# EAGLE design cable (EAGLE 7.7.0)
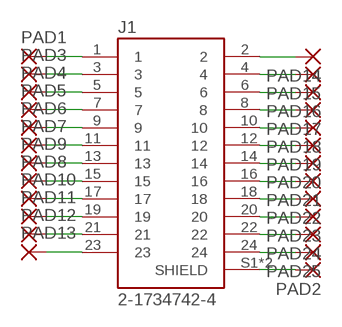
[diagram p0: schematic, sheet 1]

## Parts
J1  2-1734742-4  [TE_2-1734742-4]
PAD1  SMD2  [SMD1,27-2,54]
PAD2  SMD2  [SMD1,27-2,54]
PAD3  SMD2  [SMD1,27-2,54]
PAD4  SMD2  [SMD1,27-2,54]
PAD5  SMD2  [SMD1,27-2,54]
PAD6  SMD2  [SMD1,27-2,54]
PAD7  SMD2  [SMD1,27-2,54]
PAD8  SMD2  [SMD1,27-2,54]
PAD9  SMD2  [SMD1,27-2,54]
PAD10  SMD2  [SMD1,27-2,54]
PAD11  SMD2  [SMD1,27-2,54]
PAD12  SMD2  [SMD1,27-2,54]
PAD13  SMD2  [SMD1,27-2,54]
PAD14  SMD2  [SMD1,27-2,54]
PAD15  SMD2  [SMD1,27-2,54]
PAD16  SMD2  [SMD1,27-2,54]
PAD17  SMD2  [SMD1,27-2,54]
PAD18  SMD2  [SMD1,27-2,54]
PAD19  SMD2  [SMD1,27-2,54]
PAD20  SMD2  [SMD1,27-2,54]
PAD21  SMD2  [SMD1,27-2,54]
PAD22  SMD2  [SMD1,27-2,54]
PAD23  SMD2  [SMD1,27-2,54]
PAD24  SMD2  [SMD1,27-2,54]
PAD25  SMD2  [SMD1,27-2,54]

## Nets
N$1: J1.2 PAD14.1(P)
N$2: J1.4 PAD15.1(P)
N$3: J1.6 PAD16.1(P)
N$4: J1.8 PAD17.1(P)
N$5: J1.10 PAD18.1(P)
N$6: J1.12 PAD19.1(P)
N$7: J1.14 PAD20.1(P)
N$8: J1.16 PAD21.1(P)
N$9: J1.18 PAD22.1(P)
N$10: J1.20 PAD23.1(P)
N$11: J1.22 PAD24.1(P)
N$12: J1.24 PAD25.1(P)
N$13: J1.1 PAD1.1(P)
N$14: J1.3 PAD3.1(P)
N$15: J1.5 PAD4.1(P)
N$16: J1.7 PAD5.1(P)
N$17: J1.9 PAD6.1(P)
N$18: J1.11 PAD7.1(P)
N$19: J1.13 PAD9.1(P)
N$20: J1.15 PAD8.1(P)
N$21: J1.17 PAD10.1(P)
N$22: J1.19 PAD11.1(P)
N$23: J1.21 PAD12.1(P)
N$24: J1.23 PAD13.1(P)
N$25: J1.S1(SHIELD) J1.S2(SHIELD) PAD2.1(P)

## Library data of the parts
J1 = 2-1734742-4:2-1734742-4: Conn FPC Connector SKT 24 POS 0.5mm Solder ST SMD T/R; AVAILABILITY: Unavailable; COMMENT: 2-1734742-4; DESCRIPTION: Conn FPC Connector SKT 24 POS 0.5mm Solder ST SMD T/R; EU_ROHS_COMPLIANCE: Compliant; MF: TE Connectivity; MP: 2-1734742-4; PACKAGE: None; PRICE: None; TE_PURCHASE_URL: https://www.te.com/usa-en/product-2-1734742-4.html?te_bu=Cor&te_type=disp&te_campaign=seda_glo_cor-seda-global-disp-prtnr-fy19-seda-model-bom-cta_sma-317_1&elqCampaignId=32493
PAD1-PAD25 = wirepad:SMD2: SMD PAD

## Board
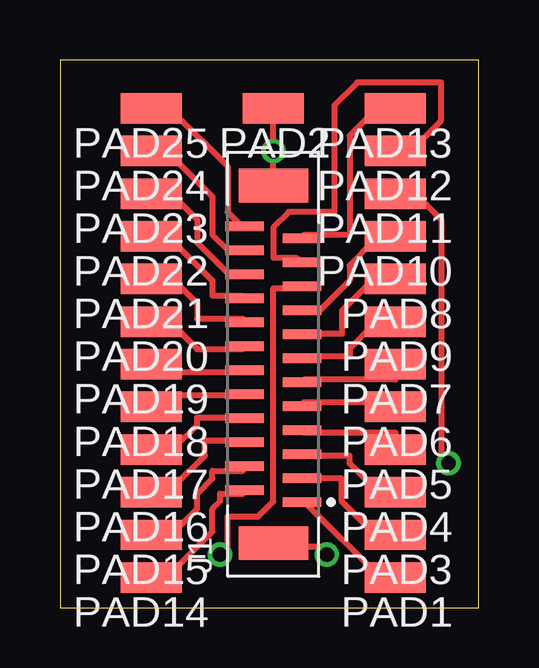
[diagram p1: board, top side]
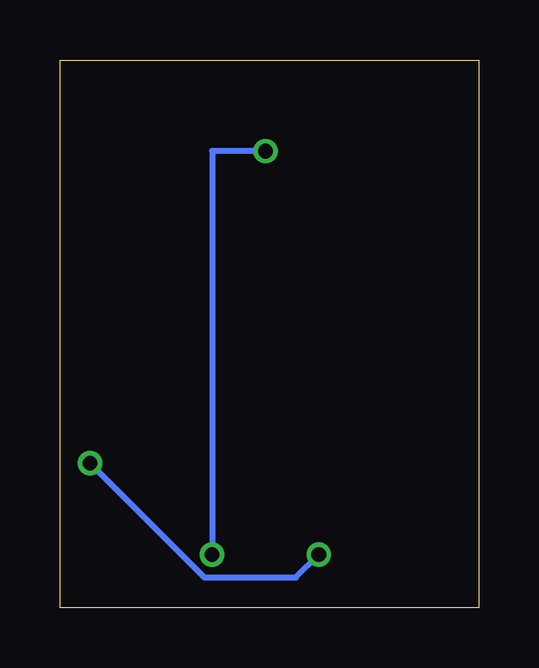
[diagram p2: board, bottom side, seen from below]

Size 17.45 x 22.85 mm. Coordinates in mm from the lower left corner, seen from the top.
Outline: 0,0 17.45,0 17.45,22.85 0,22.85 0,0
Copper layers (1*16): Top 0.035mm / dielectric 1.5mm / Bottom 0.035mm
Design rules "default": minimum track width 10mil, minimum drill 24mil, track to track 8mil, track to pad 8mil, pad to pad 8mil, via to via 8mil, smd to smd 8mil, copper to edge 40mil, drill to drill 8mil, minimum pad ring 10mil, minimum via ring 8mil, stop-mask expansion 4mil, vias tented up to drill 0mil, thermal gap 10mil

### Footprints (pad centres in the part's own frame; a part is rotated, then mirrored left to right if it is on the bottom)
TE_2-1734742-4 = smd 0.4 x 1.6: 1 -5.75,-1.2; 2 -5.25,1.2; 3 -4.75,-1.2; 4 -4.25,1.2; 5 -3.75,-1.2; 6 -3.25,1.2; 7 -2.75,-1.2; 8 -2.25,1.2; 9 -1.75,-1.2; 10 -1.25,1.2; 11 -0.75,-1.2; 12 -0.25,1.2; 13 0.25,-1.2; 14 0.75,1.2; 15 1.25,-1.2; 16 1.75,1.2; 17 2.25,-1.2; 18 2.75,1.2; 19 3.25,-1.2; 20 3.75,1.2; 21 4.25,-1.2; 22 4.75,1.2; 23 5.25,-1.2; 24 5.75,1.2 | smd 1.4 x 2.9: S1 7.45,0; S2 -7.45,0
SMD1,27-2,54 = smd 1.27 x 2.54: 1 0,0

### Placement (x,y rotation side)
J1  8.89,10.16 90 top
PAD1  13.97,1.27 90 top
PAD2  8.89,20.83 90 top
PAD3  13.97,3.05 90 top
PAD4  13.97,4.83 90 top
PAD5  13.97,6.6 90 top
PAD6  13.97,8.38 90 top
PAD7  13.97,10.16 90 top
PAD8  13.97,13.72 90 top
PAD9  13.97,11.94 90 top
PAD10  13.97,15.49 90 top
PAD11  13.97,17.27 90 top
PAD12  13.97,19.05 90 top
PAD13  13.97,20.83 90 top
PAD14  3.81,1.27 90 top
PAD15  3.81,3.05 90 top
PAD16  3.81,4.83 90 top
PAD17  3.81,6.6 90 top
PAD18  3.81,8.38 90 top
PAD19  3.81,10.16 90 top
PAD20  3.81,11.94 90 top
PAD21  3.81,13.72 90 top
PAD22  3.81,15.49 90 top
PAD23  3.81,17.27 90 top
PAD24  3.81,19.05 90 top
PAD25  3.81,20.83 90 top

### Tracks (layer width: path | path; a pad name or v marks a point on that pad's centre or on a via)
N$1
  Top 0.254: PAD14.1 4.45,1.27 6.35,3.17 6.35,4.13 6.67,4.45 6.67,4.76 7.62,4.76 J1.2
N$2
  Top 0.254: J1.4 7.62,5.71 6.35,5.71 6.35,5.4 5.71,4.76 5.71,4.13 4.76,3.17 3.81,3.17 PAD15.1
N$3
  Top 0.254: J1.6 7.62,6.99 6.03,6.99 6.03,6.35 4.76,5.08 3.81,5.08 PAD16.1
N$4
  Top 0.254: J1.8 7.62,7.94 5.71,7.94 5.71,7.62 4.76,6.67 3.81,6.67 PAD17.1
N$5
  Top 0.254: PAD18.1 3.81,8.89 7.62,8.89 J1.10
N$6
  Top 0.254: PAD19.1 3.81,9.84 7.62,9.84 J1.12
N$7
  Top 0.254: J1.14 7.62,10.79 5.71,10.79 4.76,11.75 3.81,11.75 PAD20.1
N$8
  Top 0.254: J1.16 7.62,12.06 5.71,12.06 5.71,12.7 4.76,13.65 3.81,13.65 PAD21.1
N$9
  Top 0.254: J1.18 7.62,13.02 6.35,13.02 6.35,13.65 4.76,15.24 3.81,15.24 PAD22.1
N$10
  Top 0.254: J1.20 7.62,13.97 6.99,13.97 5.71,15.24 5.71,16.19 4.76,17.14 3.81,17.14 PAD23.1
N$11
  Top 0.254: PAD24.1 4.45,19.05 6.35,17.14 6.35,15.56 6.99,14.92 7.62,14.92 J1.22
N$12
  Top 0.254: J1.24 7.62,15.88 6.99,16.51 6.99,18.41 4.76,20.64 3.81,20.64 PAD25.1
N$13
  Top 0.254: PAD1.1 13.34,1.27 10.16,4.45 J1.1
N$14
  Top 0.254: J1.3 10.16,5.4 11.75,5.4 11.75,4.45 13.02,3.17 13.97,3.17 PAD3.1
N$15
  Top 0.254: J1.5 10.16,6.35 12.06,6.35 12.06,6.03 13.02,5.08 13.97,5.08 PAD4.1
N$16
  Top 0.254: PAD5.1 13.97,7.3 10.16,7.3 J1.7
N$17
  Top 0.254: J1.9 10.16,8.57 13.97,8.57 PAD6.1
N$18
  Top 0.254: PAD7.1 13.97,9.53 10.16,9.53 J1.11
N$19
  Top 0.254: J1.13 10.16,10.48 12.06,10.48 12.06,10.79 13.02,11.75 13.97,11.75 PAD9.1
N$20
  Top 0.254: J1.15 10.16,11.43 11.75,11.43 11.75,12.38 13.02,13.65 13.97,13.65 PAD8.1
N$21
  Top 0.254: J1.17 10.16,12.38 10.79,12.38 12.06,13.65 12.06,14.29 13.02,15.24 13.97,15.24 PAD10.1
N$22  (via drill 0.61)
  Top 0.254: v6.67,2.22 6.99,2.54 6.99,3.81 8.26,3.81 8.89,4.45 8.89,13.34 9.84,13.34 J1.19 | v16.19,6.03 15.88,6.35 15.88,16.19 14.92,17.14 13.97,17.14 PAD11.1
  Bottom 0.254: v6.67,2.22 7.62,1.27 11.43,1.27 v16.19,6.03
N$23
  Top 0.254: PAD12.1 14.61,19.05 15.88,20.32 15.88,21.91 12.38,21.91 11.43,20.95 11.43,16.51 9.53,16.51 8.89,15.88 8.89,14.61 9.84,14.61 J1.21
N$24
  Top 0.254: J1.23 10.16,15.56 12.06,15.56 12.06,19.68 13.02,20.64 13.97,20.64 PAD13.1
N$25  (via drill 0.61)
  Top 0.254: J1.S1 v8.89,19.05 PAD2.1 | v11.11,2.22 11.11,2.54 8.89,2.54 J1.S2
  Bottom 0.254: v11.11,2.22 11.11,19.05 v8.89,19.05